# Altium schematic sheet USB.SchDoc
size A4; SheetNumber: 6; SheetTotal: 10
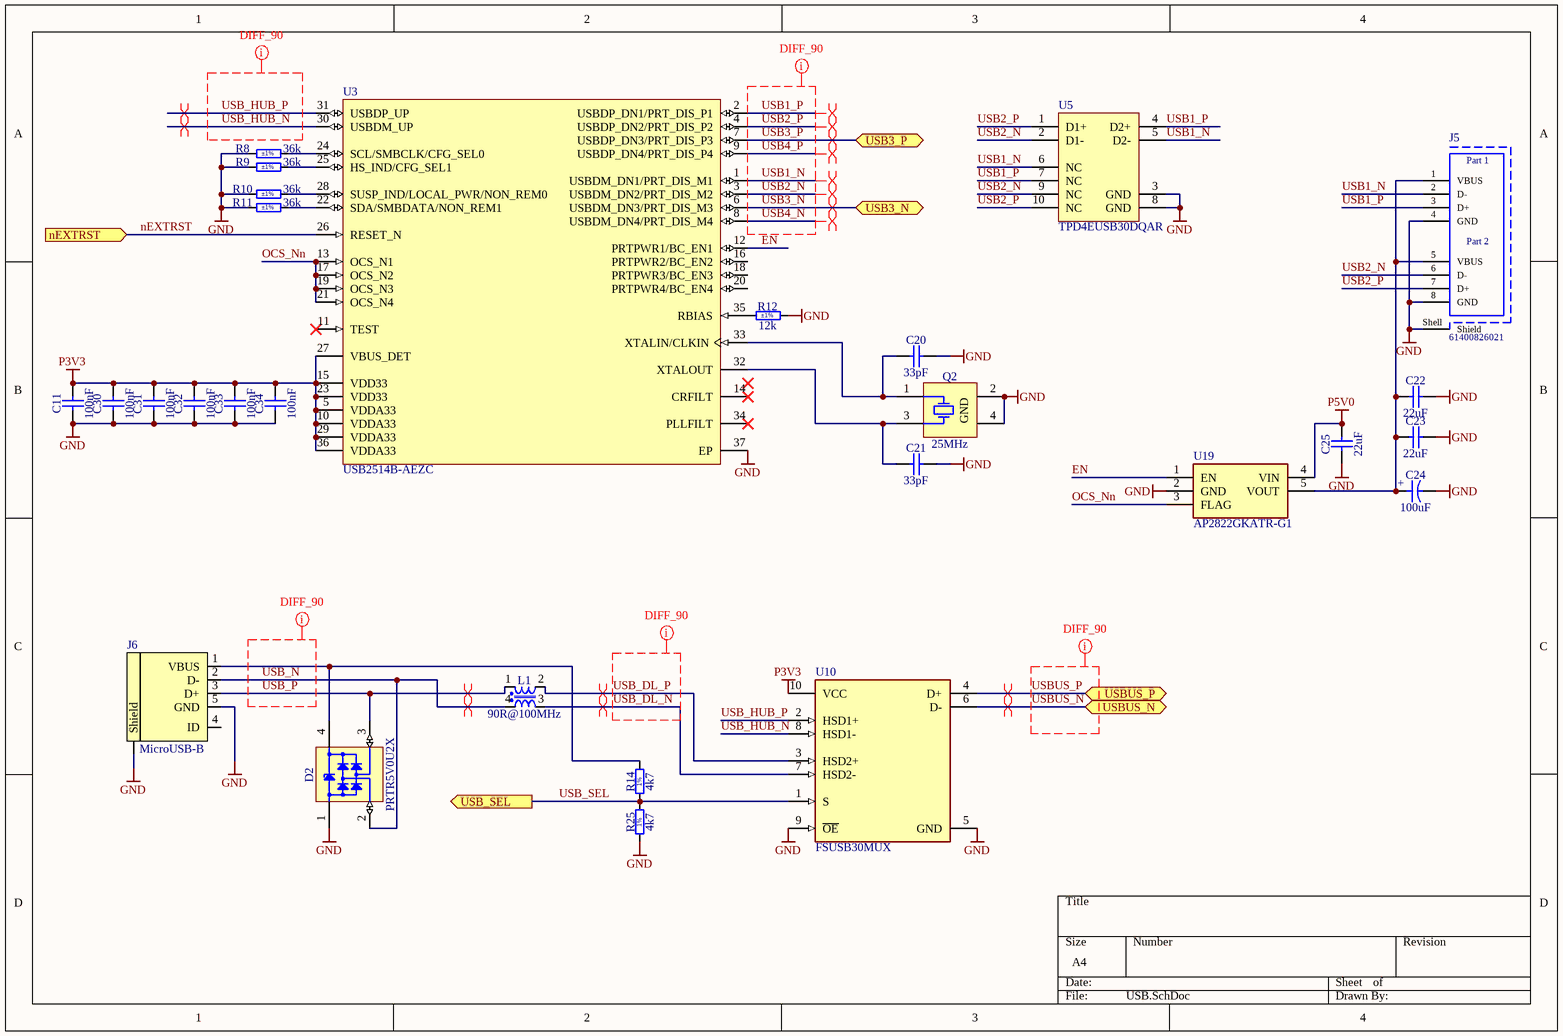
[diagram p0: USB.SchDoc]

## Parts
C11  100nF  [CAPC1005X55N]
C20  33pF  [CAPC1005X55N]
C21  33pF  [CAPC1005X55N]
C22  22uF  [CAPC2012X135N]
C23  22uF  [CAPC2012X135N]
C24  100uF  [CAPMP3216X180N]
C25  22uF  [CAPC2012X135N]
C30  100nF  [CAPC1005X55N]
C31  100nF  [CAPC1005X55N]
C32  100nF  [CAPC1005X55N]
C33  100nF  [CAPC1005X55N]
C34  100nF  [CAPC1005X55N]
D2  PRTR5V0U2X  [SOT190P230X110-4N]
J5  61400826021  [61400826021]
J6  MicroUSB-B  [USB-Micro-B-RA-SMD-PiP]
L1  90R@100MHz  [IND_MURATA_DLW21S]
Q2  25MHz  [XTAL_EPSON_TSX-3225]
R8  36k  Tolerance: ±1%  [RESC1005X40N]
R9  36k  Tolerance: ±1%  [RESC1005X40N]
R10  36k  Tolerance: ±1%  [RESC1005X40N]
R11  36k  Tolerance: ±1%  [RESC1005X40N]
R12  12k  Tolerance: ±1%  [RESC1005X40N]
R14  4k7  [RESC1005X40N]
R25  4k7  [RESC1005X40N]
U3  USB2514B-AEZC  [MCHP-QFN-36_V]
U5  TPD4EUSB30DQAR  [DQA0010A_V]
U10  FSUSB30MUX  [FP-846AP-IPC_C]
U19  AP2822GKATR-G1  [SOT95P282X145-5N]

## Ports
nEXTRST (in), USB3_N (bidir), USB3_P (bidir), USB_SEL (out), USBUS_N (bidir), USBUS_P (bidir)

## Nets
GND: C11.1 C20.2 C21.2 C22.2 C23.2 C24.2 C25.1 C30.1 C31.1 C32.1 C33.1 C34.1 D2.1(GND) J5.4(GND) J5.8(GND) J5.Shell(Shield) J6.5(GND) J6.6(Shield) Q2.2(GND) Q2.4(GND) R8.1 R9.1 R10.1 R11.1 R12.2 R25.1 U3.37(EP) U5.3(GND) U5.8(GND) U10.5(GND) U10.9(~{OE}) U19.2(GND)
P3V3: C11.2 C30.2 C31.2 C32.2 C33.2 C34.2 U3.5(VDDA33) U3.10(VDDA33) U3.15(VDD33) U3.23(VDD33) U3.27(VBUS_DET) U3.29(VDDA33) U3.36(VDDA33) U10.10(VCC)
P5V0: C25.2 U19.4(VIN)
EN: U3.12(PRTPWR1/BC_EN1) U19.1(EN)
nEXTRST: U3.26(RESET_N) ; port nEXTRST
OCS_Nn: U3.13(OCS_N1) U3.17(OCS_N2) U3.19(OCS_N3) U3.21(OCS_N4) U19.3(FLAG)
USB1_N: J5.2(D-) U3.1(USBDM_DN1/PRT_DIS_M1) U5.5(D2-) U5.6(NC)
USB1_P: J5.3(D+) U3.2(USBDP_DN1/PRT_DIS_P1) U5.4(D2+) U5.7(NC)
USB2_N: J5.6(D-) U3.3(USBDM_DN2/PRT_DIS_M2) U5.2(D1-) U5.9(NC)
USB2_P: J5.7(D+) U3.4(USBDP_DN2/PRT_DIS_P2) U5.1(D1+) U5.10(NC)
USB3_N: U3.6(USBDM_DN3/PRT_DIS_M3) ; port USB3_N
USB3_P: U3.7(USBDP_DN3/PRT_DIS_P3) ; port USB3_P
USB4_N: U3.8(USBDM_DN4/PRT_DIS_M4)
USB4_P: U3.9(USBDP_DN4/PRT_DIS_P4)
USB_DL_N: L1.3 U10.7(HSD2-)
USB_DL_P: L1.2 U10.3(HSD2+)
USB_HUB_N: U3.30(USBDM_UP) U10.8(HSD1-)
USB_HUB_P: U3.31(USBDP_UP) U10.2(HSD1+)
USB_N: D2.2(I/O1) J6.2(D-) L1.4
USB_P: D2.3(I/O2) J6.3(D+) L1.1
USB_SEL: R14.1 R25.2 U10.1(S) ; port USB_SEL
USBUS_N: U10.6(D-) ; port USBUS_N
USBUS_P: U10.4(D+) ; port USBUS_P
NetC20_1: C20.1 Q2.1(X) U3.33(XTALIN/CLKIN)
NetC21_1: C21.1 Q2.3(X) U3.32(XTALOUT)
NetC22_1: C22.1 C23.1 C24.1 J5.1(VBUS) J5.5(VBUS) U19.5(VOUT)
NetD2_4: D2.4(VCC) J6.1(VBUS) R14.2
NetR8_2: R8.2 U3.24(SCL/SMBCLK/CFG_SEL0)
NetR9_2: R9.2 U3.25(HS_IND/CFG_SEL1)
NetR10_2: R10.2 U3.28(SUSP_IND/LOCAL_PWR/NON_REM0)
NetR11_2: R11.2 U3.22(SDA/SMBDATA/NON_REM1)
NetR12_1: R12.1 U3.35(RBIAS)

Not connected (* = marked no-connect by the designer): J6 4(ID); U3 11(TEST)* 14(CRFILT)* 16(PRTPWR2/BC_EN2) 18(PRTPWR3/BC_EN3) 20(PRTPWR4/BC_EN4) 34(PLLFILT)*

## Layout directives
differential pair: USB1_N, USB1_P, USB2_N, USB2_P, USB3_N, USB3_P, USB4_N, USB4_P, USB_DL_N, USB_DL_P, USB_HUB_N, USB_HUB_P, USB_N, USB_P, USBUS_N, USBUS_P
net class DIFF_90: USB1_N, USB1_P, USB2_N, USB2_P, USB3_N, USB3_P, USB4_N, USB4_P, USB_DL_N, USB_DL_P, USB_HUB_N, USB_HUB_P, USB_N, USB_P, USBUS_N, USBUS_P

## Notes on the sheet
- (in symbol CMP-1502-03229-1) Part 1; Part 2
- (in symbol CTE3216-18_100UF_6.3V_20%_ESR0500_AVX_TLJ) +
- (in symbol R0402_4K7_1%_0.0625W_100PPM) 1%

## Library data of the parts
C11 C30-C34 = CC0402_100NF_16V_10%_X5R: Non-polarised capacitor; Part Description: SMD Multilayer Chip Ceramic Capacitor; Manufacturer: GENERIC; Manufacturer1 Part Number: GRM155R61C104KA88D; Voltage: 16V; TC: X5R; Tolerance: ±10%; Part Number: CC0402_100NF_16V_10%_X5R; Component Kind: Standard; Component Type: Standard; Pin Count: 2; Value: 100nF; Status: None; Manufacturer Part Number: CC0402_100NF_16V_10%_X5R; Case: 0402; Mounted: Yes; Socket: No; SMD: Yes; Sense: No; Manufacturer1 Example: MURATA; Manufacturer1 ComponentHeight: 0.55mm; HelpURL: \\cern.ch\dfs\Applications\Altium\Datasheets\CC0402_X5R_MURATA_GRM.pdf; Author: CERN DEM JLC; CreateDate: 10.12.2013; LatestRevisionDate: 10.12.2013
C20 C21 = CC0402_33PF_50V_5%_C0G: Non-polarised capacitor; Part Description: SMD Multilayer Chip Ceramic Capacitor; Manufacturer: GENERIC; Manufacturer1 Part Number: C0402C330J5GACTU; Voltage: 50V; TC: C0G/NP0; Tolerance: ±5%; Part Number: CC0402_33PF_50V_5%_C0G; Component Kind: Standard; Component Type: Standard; Pin Count: 2; Value: 33pF; Status: Preferred; Manufacturer Part Number: CC0402_33PF_50V_5%_C0G; Case: 0402; Mounted: Yes; Socket: No; SMD: Yes; Sense: No; Manufacturer1 Example: KEMET; Manufacturer1 ComponentHeight: 0.55mm; HelpURL: \\cern.ch\dfs\Applications\Altium\Datasheets\CC0805_C0G_KEMET_(Commercial Grade).pdf; Author: CERN DEM JLC; CreateDate: 03.12.2007; LatestRevisionDate: 22.04.2015
C22 C23 C25 = CC0805_22UF_10V_+80%-20%_Y5V: Non-polarised capacitor; Part Description: SMD Multilayer Chip Ceramic Capacitor; Manufacturer: GENERIC; Manufacturer1 Part Number: 2222 241 19881; Voltage: 10V; TC: Y5V; Part Number: CC0805_22UF_10V_+80%-20%_Y5V; Component Kind: Standard; Component Type: Standard; Pin Count: 2; Value: 22uF; Status: Preferred; Tolerance: +80% -20%; Manufacturer Part Number: CC0805_22UF_10V_+80%-20%_Y5V; Case: 0805; Mounted: Yes; Socket: No; SMD: Yes; Sense: No; Manufacturer1 Example: PHYCOMP; Manufacturer1 ComponentHeight: 1.45mm; HelpURL: \\cern.ch\dfs\Applications\Altium\Datasheets\CC0805_Y5V_PHYCOMP.pdf; Author: CERN DEM JLC; CreateDate: 03.12.2007; LatestRevisionDate: 03.12.2007
C24 = CTE3216-18_100UF_6.3V_20%_ESR0500_AVX_TLJ: Polarised capacitor; Part Description: ESR 0R5 Solid Tantalum Chip Capacitor; Manufacturer: AVX; Manufacturer Part Number: TLJA107M006R0500; Voltage: 6.3V; Tolerance: ±20%; Part Number: CTE3216-18_100UF_6.3V_20%_ESR0500_AVX_TLJ; Component Kind: Standard; Component Type: Standard; Pin Count: 2; Value: 100uF; Status: None; Case: A; Mounted: Yes; Socket: No; SMD: Yes; Sense: No; ComponentHeight: 1.8mm; HelpURL: \\cern.ch\dfs\Applications\Altium\Datasheets\CTE_AVX_TLJ.pdf; Author: CERN DEM JLC; CreateDate: 19.12.2013; LatestRevisionDate: 19.12.2013
D2 = PRTR5V0U2X: Ultra Low Capacitance Double Rail-to-Rail ESD Protection Diode; Part Description: Ultra Low Capacitance (1pF) Double Rail-to-Rail ESD Protection Diode (8kV); Manufacturer: NXP SEMICONDUCTORS; Voltage: 5.5V; PressFit: No; Bonding: No; Part Number: PRTR5V0U2X; Component Kind: Standard; Component Type: Standard; Device: PRTR5V0U2X; PackageDescription: SOT143B, SOT, 1.90mm Pitch; 4 Pin, 1.30mm W X 2.90mm L X 1.10mm H body, IPC Medium Density; Manufacturer Part Number: PRTR5V0U2X; Pin Count: 4; Case: SOT143B; Mounted: Yes; Socket: No; SMD: Yes; Sense: No; ComponentHeight: 1.1mm; HelpURL: \\cern.ch\dfs\Applications\Altium\Datasheets\PRTR5V0U2X.pdf; Author: CERN DEM JLC; CreateDate: 22.03.2011; LatestRevisionDate: 22.03.2011
J5 = CMP-1502-03229-1: USB 2.0 Type A Receptacle WR-COM, Stacked Horizontal, THT; Manufacturer: Wurth Elektronik; Contact Resistance: 20mOhm; Rated Current: 1.5A; Working Voltage: 30VAC; Connector Type: USB2.0TypeA; Packaging: Tray; Package Reference: 61400826021; Mounting Technology: THT; Datasheet URL: https://katalog.we-online.de/em/datasheet/61400826021.pdf; Operating Temperature: -40to105degC; Gender: Receptacle; Orientation: StackedHorizontal; Part Number: 61400826021; Publisher: WurthElektronik; Manufacturer URL: http://www.we-online.de
J6 = MiniUSB-AB-SMT: MicroUSB-B-SMT; Manufacturer: Allen Creations Corp.; Manufacturer Part Number: AJU55-BS2111-L; 2nd source part number: 609-4616-1-ND; Artikkelnr Noca: 55029020; Artikkelnr Simpro: N.A.; Part Number: USB-Micro-B-RA-SMD-PiP; Datasheet: \\hizz\pro\app9717\Datasheet\connectores\Allen Creations Corp\AJU-211.pdf; Footprint Doc: USB-Micro-B-RA-SMD-PiP; LatestRevisionDate: 2016-04-21; Pin Count: 5; Publisher: Nordic Semiconductor; Published: 2014-10-07; Value: MicroUSB-B; Note: *; Supplier: Cabcon; Supplier part number: AJU55-BS2111-L; 2nd source Supplier: Digi-Key
L1 = IND_MURATA_DLW21SN900SQ2L: Inductor Common Mode; Part Description: Wire Wound Common Mode Choke Coil (DLW21S Series); Manufacturer: MURATA; Power: 330mA; Resistance: 0.35R; Tolerance: ±25%; Part Number: IND_MURATA_DLW21SN900SQ2L; Component Kind: Standard; Component Type: Standard; Pin Count: 4; Value: 90R@100MHz; Status: None; Manufacturer Part Number: DLW21SN900SQ2L; Case: 0805; Mounted: Yes; Socket: No; SMD: Yes; Sense: No; ComponentHeight: 1.4mm; HelpURL: \\cern.ch\dfs\Applications\Altium\Datasheets\IND_MURATA_DLW21S.pdf; Author: CERN DEM JLC; CreateDate: 01.07.2014; LatestRevisionDate: 01.07.2014
Q2 = XTAL_25MHZ_EPSON_TSX-3225 25.0000MF10Z-AC: Crystal 4 pins 1=XTAL Control 2=GND3=XTAL 4=GND; Part Description: Tolerance ±10 ppm,  Stability:± 10ppm, -20°C to 75°C, 9pF, Surface Mount Quartz Crystal, TX-3225 Series; Manufacturer: EPSON; PressFit: No; Bonding: No; Part Number: XTAL_25MHZ_EPSON_TSX-3225 25.0000MF10Z-AC; Component Kind: Standard; Component Type: Standard; PackageDescription: Crystal TSX-3225 Serie, Corner Concave; 4 pin, 2.50mm L X 3.2mm W X 0.6mm H; Value: 25MHz; Manufacturer Part Number: TSX-3225 25.0000MF10Z-AC; Pin Count: 4; Mounted: Yes; Socket: No; SMD: Yes; Sense: No; ComponentHeight: 0.6mm; HelpURL: \\cern.ch\dfs\Applications\Altium\Datasheets\XTAL_EPSON_TSX-3225.pdf; ComponentLink1URL: \\cern.ch\dfs\Applications\Altium\Datasheets\XTAL_EPSON_TSX-3225_Ordering-Informations.pdf; ComponentLink1Description: Ordering Informations; Author: CERN DEM JLC; CreateDate: 03.04.2012; LatestRevisionDate: 06.10.2016
R8-R11 = R0402_36K_1%_0.0625W_100PPM: Resistor - 1%; Part Description: General Purpose Thick Film Chip Resistor; Manufacturer: GENERIC; Manufacturer1 Part Number: 232270673603L; TC: ±100ppm/°C; PressFit: No; Part Number: R0402_36K_1%_0.0625W_100PPM; Component Kind: Standard; Component Type: Standard; Pin Count: 2; Value: 36k; Status: Not Recommended; Power: 0.0625W; Manufacturer Part Number: R0402_36K_1%_0.0625W_100PPM; Case: 0402; Mounted: Yes; Sense: No; Socket: No; SMD: Yes; Manufacturer1 Example: YAGEO PHYCOMP; Manufacturer1 ComponentHeight: 0.4mm; HelpURL: \\cern.ch\dfs\Applications\Altium\Datasheets\R0402_Phycomp_RC0402.pdf; Author: CERN DEM JLC; CreateDate: 03.12.2007; LatestRevisionDate: 17.10.2012
R12 = R0402_12K_1%_0.0625W_100PPM: Resistor - 1%; Part Description: General Purpose Thick Film Chip Resistor; Manufacturer: GENERIC; Manufacturer1 Part Number: 232270671203L; TC: ±100ppm/°C; PressFit: No; Part Number: R0402_12K_1%_0.0625W_100PPM; Component Kind: Standard; Component Type: Standard; Pin Count: 2; Value: 12k; Status: Not Recommended; Power: 0.0625W; Manufacturer Part Number: R0402_12K_1%_0.0625W_100PPM; Case: 0402; Mounted: Yes; Sense: No; Socket: No; SMD: Yes; Manufacturer1 Example: YAGEO PHYCOMP; Manufacturer1 ComponentHeight: 0.4mm; HelpURL: \\cern.ch\dfs\Applications\Altium\Datasheets\R0402_Phycomp_RC0402.pdf; Author: CERN DEM JLC; CreateDate: 03.12.2007; LatestRevisionDate: 17.10.2012
R14 R25 = R0402_4K7_1%_0.0625W_100PPM: Resistor - 1%; Part Description: General Purpose Thick Film Chip Resistor; Manufacturer: GENERIC; Manufacturer1 Part Number: 232270674702L; TC: ±100ppm/°C; PressFit: No; Part Number: R0402_4K7_1%_0.0625W_100PPM; Component Kind: Standard; Component Type: Standard; Pin Count: 2; Value: 4k7; Status: Not Recommended; Power: 0.0625W; Tolerance: ±1%; Manufacturer Part Number: R0402_4K7_1%_0.0625W_100PPM; Case: 0402; Mounted: Yes; Sense: No; Socket: No; SMD: Yes; Manufacturer1 Example: YAGEO PHYCOMP; Manufacturer1 ComponentHeight: 0.4mm; HelpURL: \\cern.ch\dfs\Applications\Altium\Datasheets\R0402_Phycomp_RC0402.pdf; Author: CERN DEM JLC; CreateDate: 03.12.2007; LatestRevisionDate: 17.10.2012
U3 = CMP-2000-05217-1: USB 2.0 High-Speed Hub Controller, 4 Ports, 3 to 3.6 V, 0 to 85 degC, 36-Pin QFN, RoHS, Tray; Manufacturer: Microchip; Interface: I²CEEPROM,SMBus(2-Wire,I²C); Other Names: 638-1122; Voltage - Supply: 3V~3.6V; Current - Supply: 70mA; Manufacturer URL: http://www.microchip.com/; Packaging: Tray; Function: -; Standards: -; Category: IntegratedCircuits(ICs); Package / Case: 36-VFQFNExposedPad; Supplier Device Package: 36-QFN(6x6); Family: Interface-Controllers; Datasheet Version: DS00001692C, 10/2015; Standard Package: 490; Series: -; Protocol: -; Datasheet URL: http://ww1.microchip.com/downloads/en/DeviceDoc/00001692C.pdf; Operating Temperature: -
U5 = CMP-0326-00027-3: ESD Solution for Super-Speed (6 GBPS) USB 3.0 Interface, 4 Channels, -40 to +85 degC, 10-pin SON (DQA), Green (RoHS & no Sb/Br); Manufacturer: Texas Instruments; Differential Capacitance(pF): 0.05; Serial ATA / eSATA: TRUE; IO Capacitance(Typ)(pF): 0.8; IO Leakage Current(nA): 10; IEC 61000-4-2 Air-Gap(+/- kV): 8; ComponentLink3Description: URL Link1; PartNumber: TPD4EUSB30DQAR; DatasheetVersion: SLVSAC2C; ComponentLink2URL: http://www.ti.com/general/docs/lit/getliterature.tsp?genericPartNumber=TPD4EUSB30&fileType=pdf; USB Super Speed: TRUE; Eco-Plan: Green (RoHS & no Sb/Br); Mounting Technology: Surface Mount; 1394 / Firewire: TRUE; PackageVersion: revB, Sep-2009; SubFamily: ESD Solution; USB Full Speed: TRUE; USB High Speed: TRUE; ComponentLink2Description: Datasheet; ComponentLink1URL: http://www.ti.com/; IEC 61000-4-2 Contact(+/- kV): 8; Breakdown Voltage(Min)(V): 8; PackageReference: DQA0010A; ComponentLink1Description: Manufacturer URL; PackageDescription: 10-Pin Plastic Small Outline No-Lead, 1 x 2.5 x 0.55 mm Body, 0.5 mm Pitch; ComponentLink3URL: SamplesURL:http://www.ti.com/product/tpd4eusb30#samples; HDMI: TRUE
U10 = CMP-07103-000007-1: IC USB SWITCH 2X2 10MSOP; On-State Resistance: 10R; Data Rate: 480Mbps; Max Supply Voltage: 4.3V; Supply Type: Single; Turn-Off Delay Time: 4ns; Bandwidth: 750MHz; Number of Outputs: 4; Propagation Delay: 0.25ns; Turn-On Delay Time: 7ns; USB Standard: USB 2.0; Throw Configuration: DPST; Number of Ports: 2; Drain to Source Resistance: 4.5R; Number of Channels: 1; Min Supply Voltage: 3V; Lead Free: Lead Free; Termination: SMD/SMT; Package Quantity: 1; Number of Pins: 10; REACH SVHC: No SVHC; Radiation Hardening: No; Packaging: Tape and Reel; Weight: 0.1125g; Height: 1.1mm; Min Operating Temperature: -40°C; Max Operating Temperature: 85°C; Case/Package: MSOP; Width: 3mm; Length: 3mm; Number of Inputs: 2; Mount: Surface Mount
U19 = AP2822GKATR-G1: Switch; Manufacturer_Name: Diodes Inc.; Datasheet Link: https://www.arrow.com/en/products/ap2822gkatr-g1/diodes-incorporated; Height: 1.45mm; Manufacturer_Part_Number: AP2822GKATR-G1